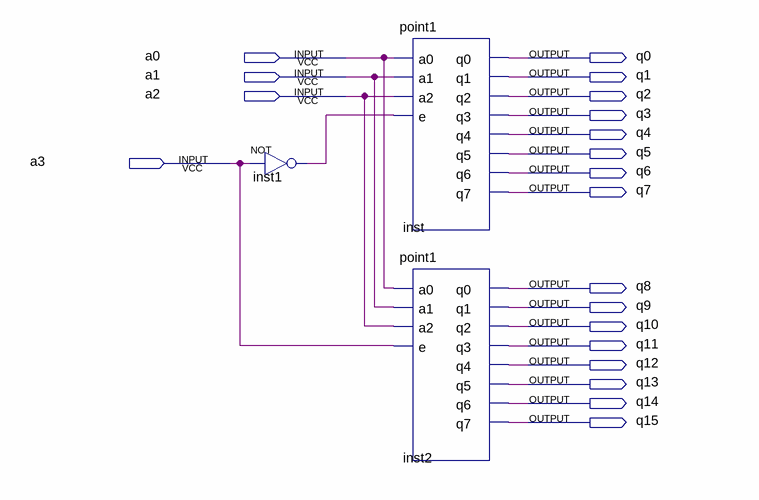
[diagram p0: schematic sheet]
// Quartus schematic point2.bdf as structural Verilog: 3 symbols, 20 pins
module point2 (
  input  a0,
  input  a1,
  input  a2,
  input  a3,
  output q0,
  output q1,
  output q2,
  output q3,
  output q4,
  output q5,
  output q6,
  output q7,
  output q8,
  output q9,
  output q10,
  output q11,
  output q12,
  output q13,
  output q14,
  output q15
);

  wire inst1_out;

  not inst1 (inst1_out, a3);
  point1 inst (
    .a0(a0), .a1(a1), .a2(a2), .e(inst1_out), .q0(q0), .q1(q1), .q2(q2), .q3(q3), .q4(q4), .q5(q5), .q6(q6),
    .q7(q7));
  point1 inst2 (
    .a0(a0), .a1(a1), .a2(a2), .e(a3), .q0(q8), .q1(q9), .q2(q10), .q3(q11), .q4(q12), .q5(q13), .q6(q14),
    .q7(q15));
endmodule
